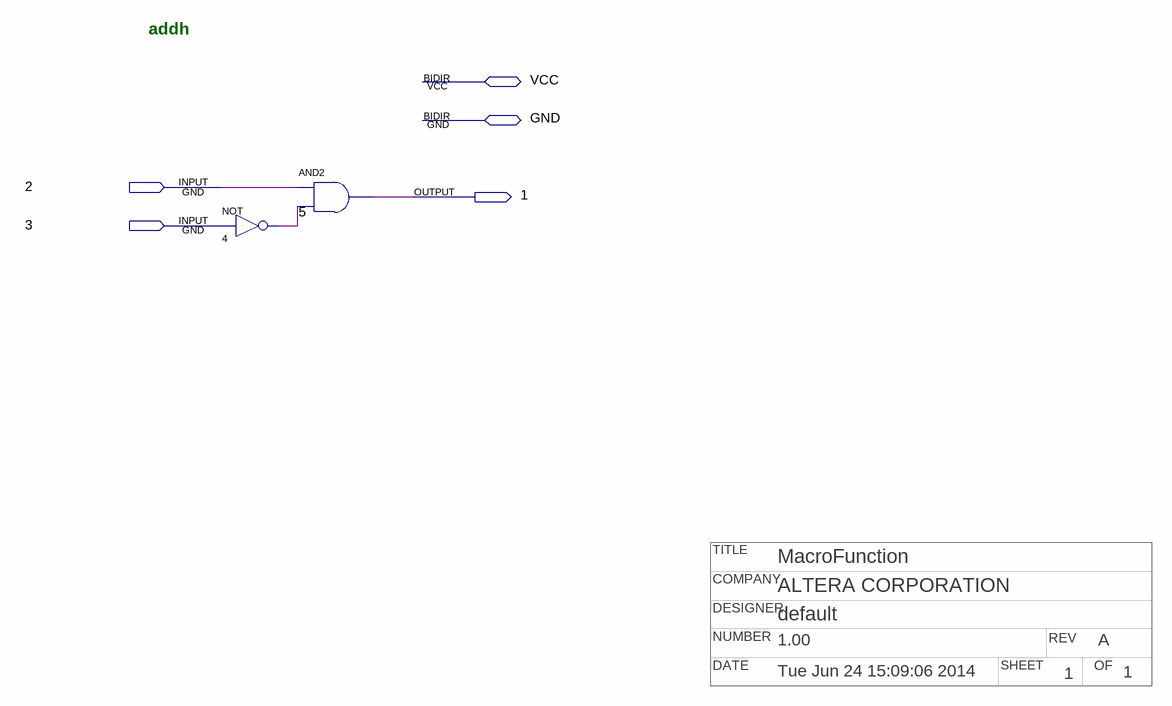
[diagram p0: schematic sheet]
// Quartus schematic npand_not.bdf as structural Verilog: 2 symbols, 5 pins
// Title block: TITLE: MacroFunction; COMPANY: ALTERA CORPORATION; DESIGNER: default; NUMBER: 1.00; REV: A; DATE: Tue Jun 24 15:09:06 2014; SHEET: 1; OF: 1
module npand_not (
  input  \2 ,
  input  \3 ,
  inout  VCC,
  inout  GND,
  output \1 
);

  wire n4_out;

  not u_4 (n4_out, \3 );
  and u_5 (\1 , \2 , n4_out);

  // Notes on the sheet:
  //   addh
endmodule
